# Altium schematic sheet H0ARAx_Frontend.SchDoc
size Letter; CompanyName: Hexabitz; DocumentNumber: 3; SheetNumber: 2; SheetTotal: 2; Module_Name: H0ARA; Module_Description: Humidity and Tempurature Sensor
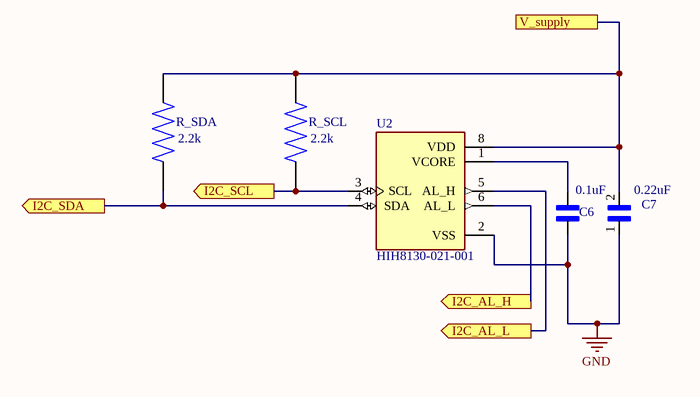
[diagram p0: H0ARAx_Frontend.SchDoc]

## Parts
C6  0.1uF  [CAPC0603X33N]
C7  0.22uF  [CAPC0603X33N]
R_SCL  2.2k  [RESC1608X55N]
R_SDA  2.2k  [RESC1608X55N]
U2  HIH8130-021-001  [SOIC127P600X206-8N]

## Ports
I2C_AL_H (out), I2C_AL_L (out), I2C_SCL (out), I2C_SDA (out), V_supply

## Nets
GND: C6.1 C7.1 U2.2(VSS)
I2C_AL_H: U2.6(AL_L) ; port I2C_AL_H
I2C_AL_L: U2.5(AL_H) ; port I2C_AL_L
I2C_SCL: R_SCL.1 U2.3(SCL) ; port I2C_SCL
I2C_SDA: R_SDA.1 U2.4(SDA) ; port I2C_SDA
V_supply: C7.2 R_SCL.2 R_SDA.2 U2.8(VDD) ; port V_supply
NetC6_2: C6.2 U2.1(VCORE)

## Notes on the sheet
- Module:
- Title:
- Description:
- Size:
- Revision:
- Letter
- www.hexabitz.com
- Date:
- Time:
- Sheet
- of

## Library data of the parts
C6 = GRM033C71C104KE14D: 0.1 ÂµF Â±10% 16V Ceramic Capacitor X7S 0201 (0603 Metric); MF: Murata Electronics; SnapEDA_Link: https://www.snapeda.com/parts/GRM033C71C104KE14D/Murata+Electronics+North+America/view-part/?ref=snap; Package: 0603 Murata; Value: *; MP: GRM033C71C104KE14D; Check_prices: https://www.snapeda.com/parts/GRM033C71C104KE14D/Murata+Electronics+North+America/view-part/?ref=eda
C7 = GRM188R71C224KA01D: SMD Capacitor X7R_EIA_ with Capacitance: 0.22uF Tol. 10%. Rated Voltage: 16Vdc; MF: Murata; SnapEDA_Link: https://www.snapeda.com/parts/GRM188R71C224KA01D/Murata%20Electronics%20North%20America/view-part/1758738/?ref=snap; Value: *; MP: GRM188R71C224KA01D; Availability: Unavailable; Package: 1608 Murata; Price: None
R_SCL R_SDA = CRGCQ0603J2K2: Fixed Resistor CRGCQ 0603 2K2 5%; MF: TE Connectivity; SnapEDA_Link: https://www.snapeda.com/parts/CRGCQ0603J2K2/TE+Connectivity/view-part/?ref=snap; Package: 1608 Rohm Semiconductor; Value: *; MP: CRGCQ0603J2K2; Check_prices: https://www.snapeda.com/parts/CRGCQ0603J2K2/TE+Connectivity/view-part/?ref=eda
U2 = HIH8130-021-001: MF: {'manufacturer': u'Honeywell Sensing and Productivity Solutions'}; Package: None; Price: None; Value: *; MP: HIH8130-021-001; Availability: Unavailable; ComponentLink1Description: Supplier link; ComponentLink1URL: https://www.digikey.com/en/products/detail/honeywell-sensing-and-productivity-solutions/HIH8130-021-001/4440796